# Altium schematic sheet VCU Schematic.SchDoc (part 1 of 2)
size E portrait; SheetNumber: 1; SheetTotal: 2
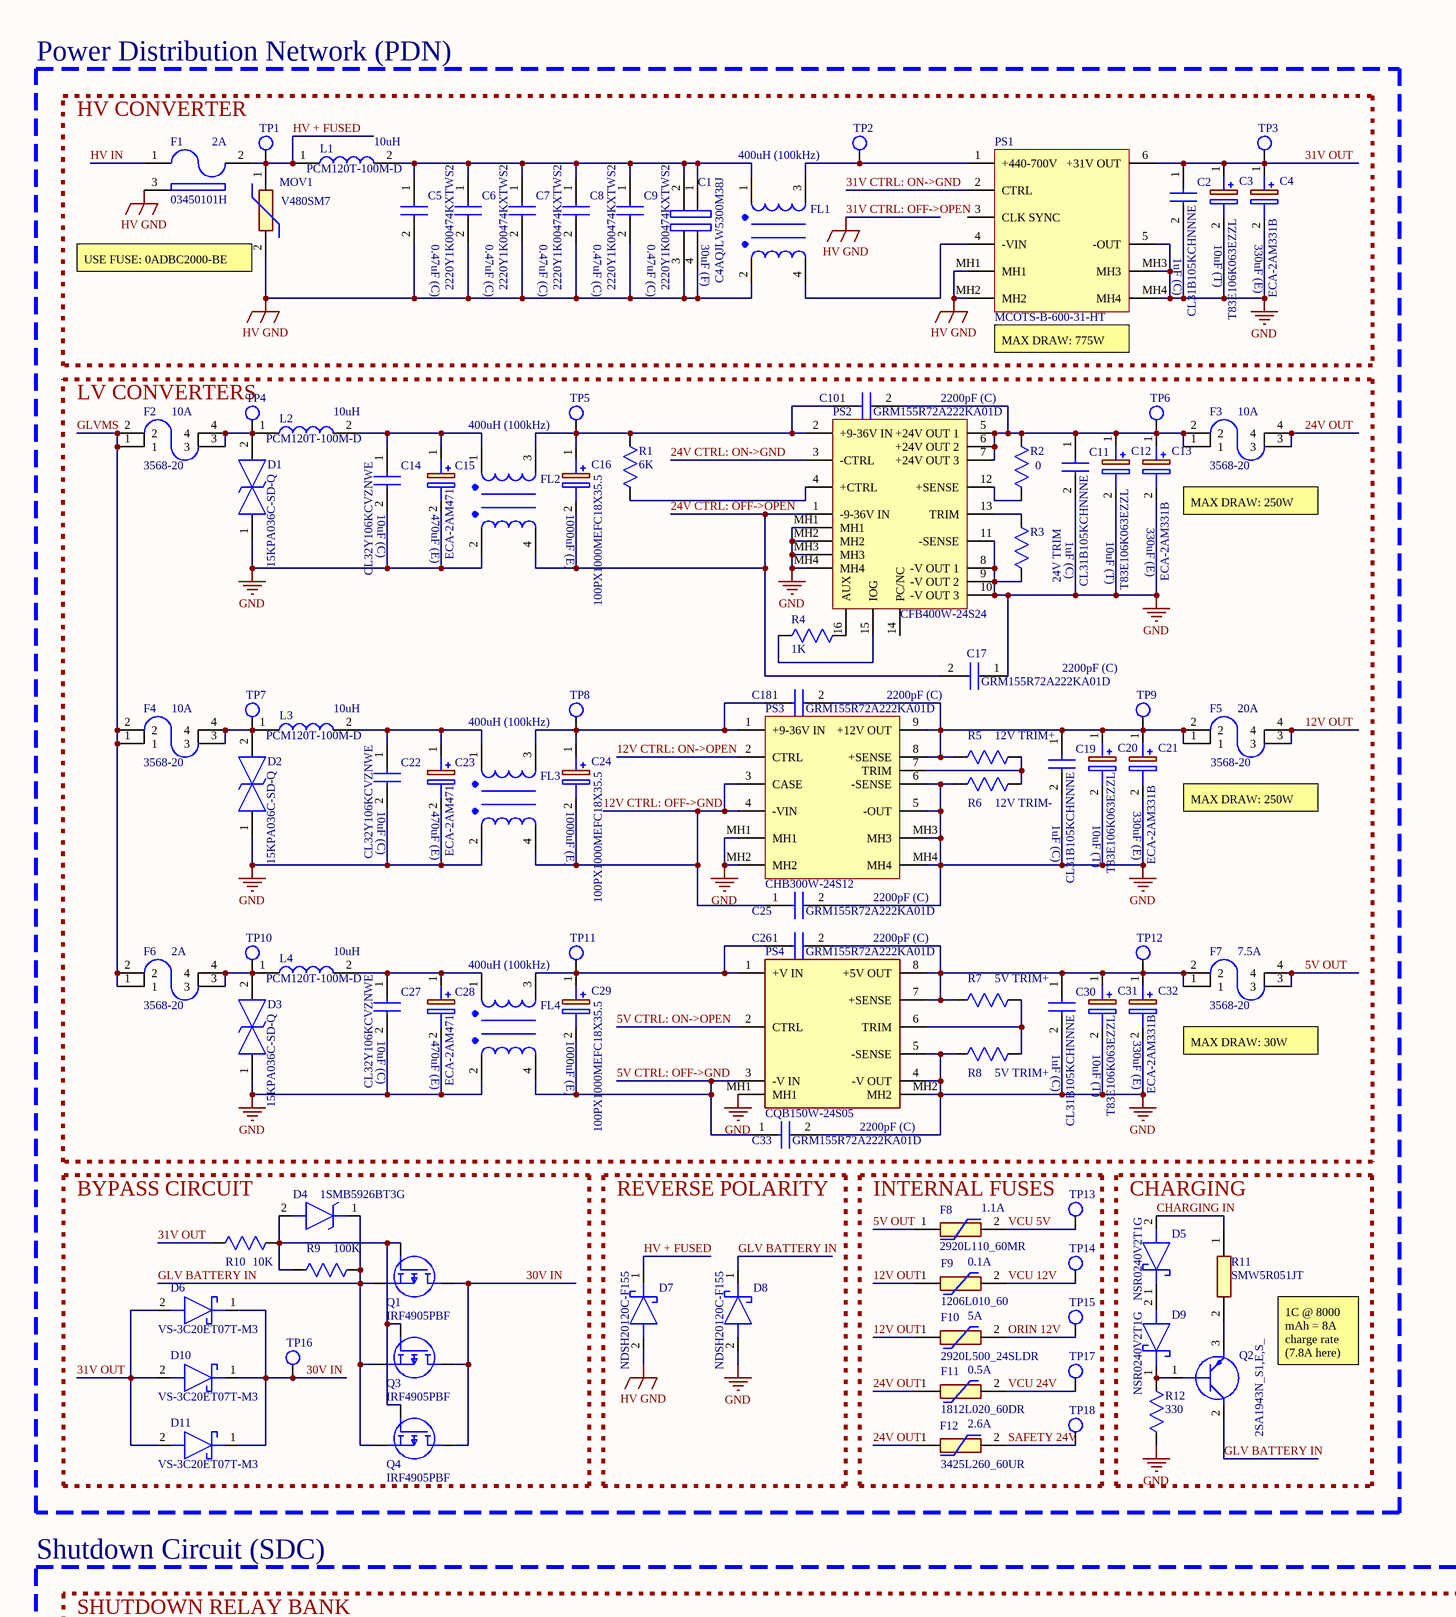
[diagram p0: VCU Schematic.SchDoc, top left]
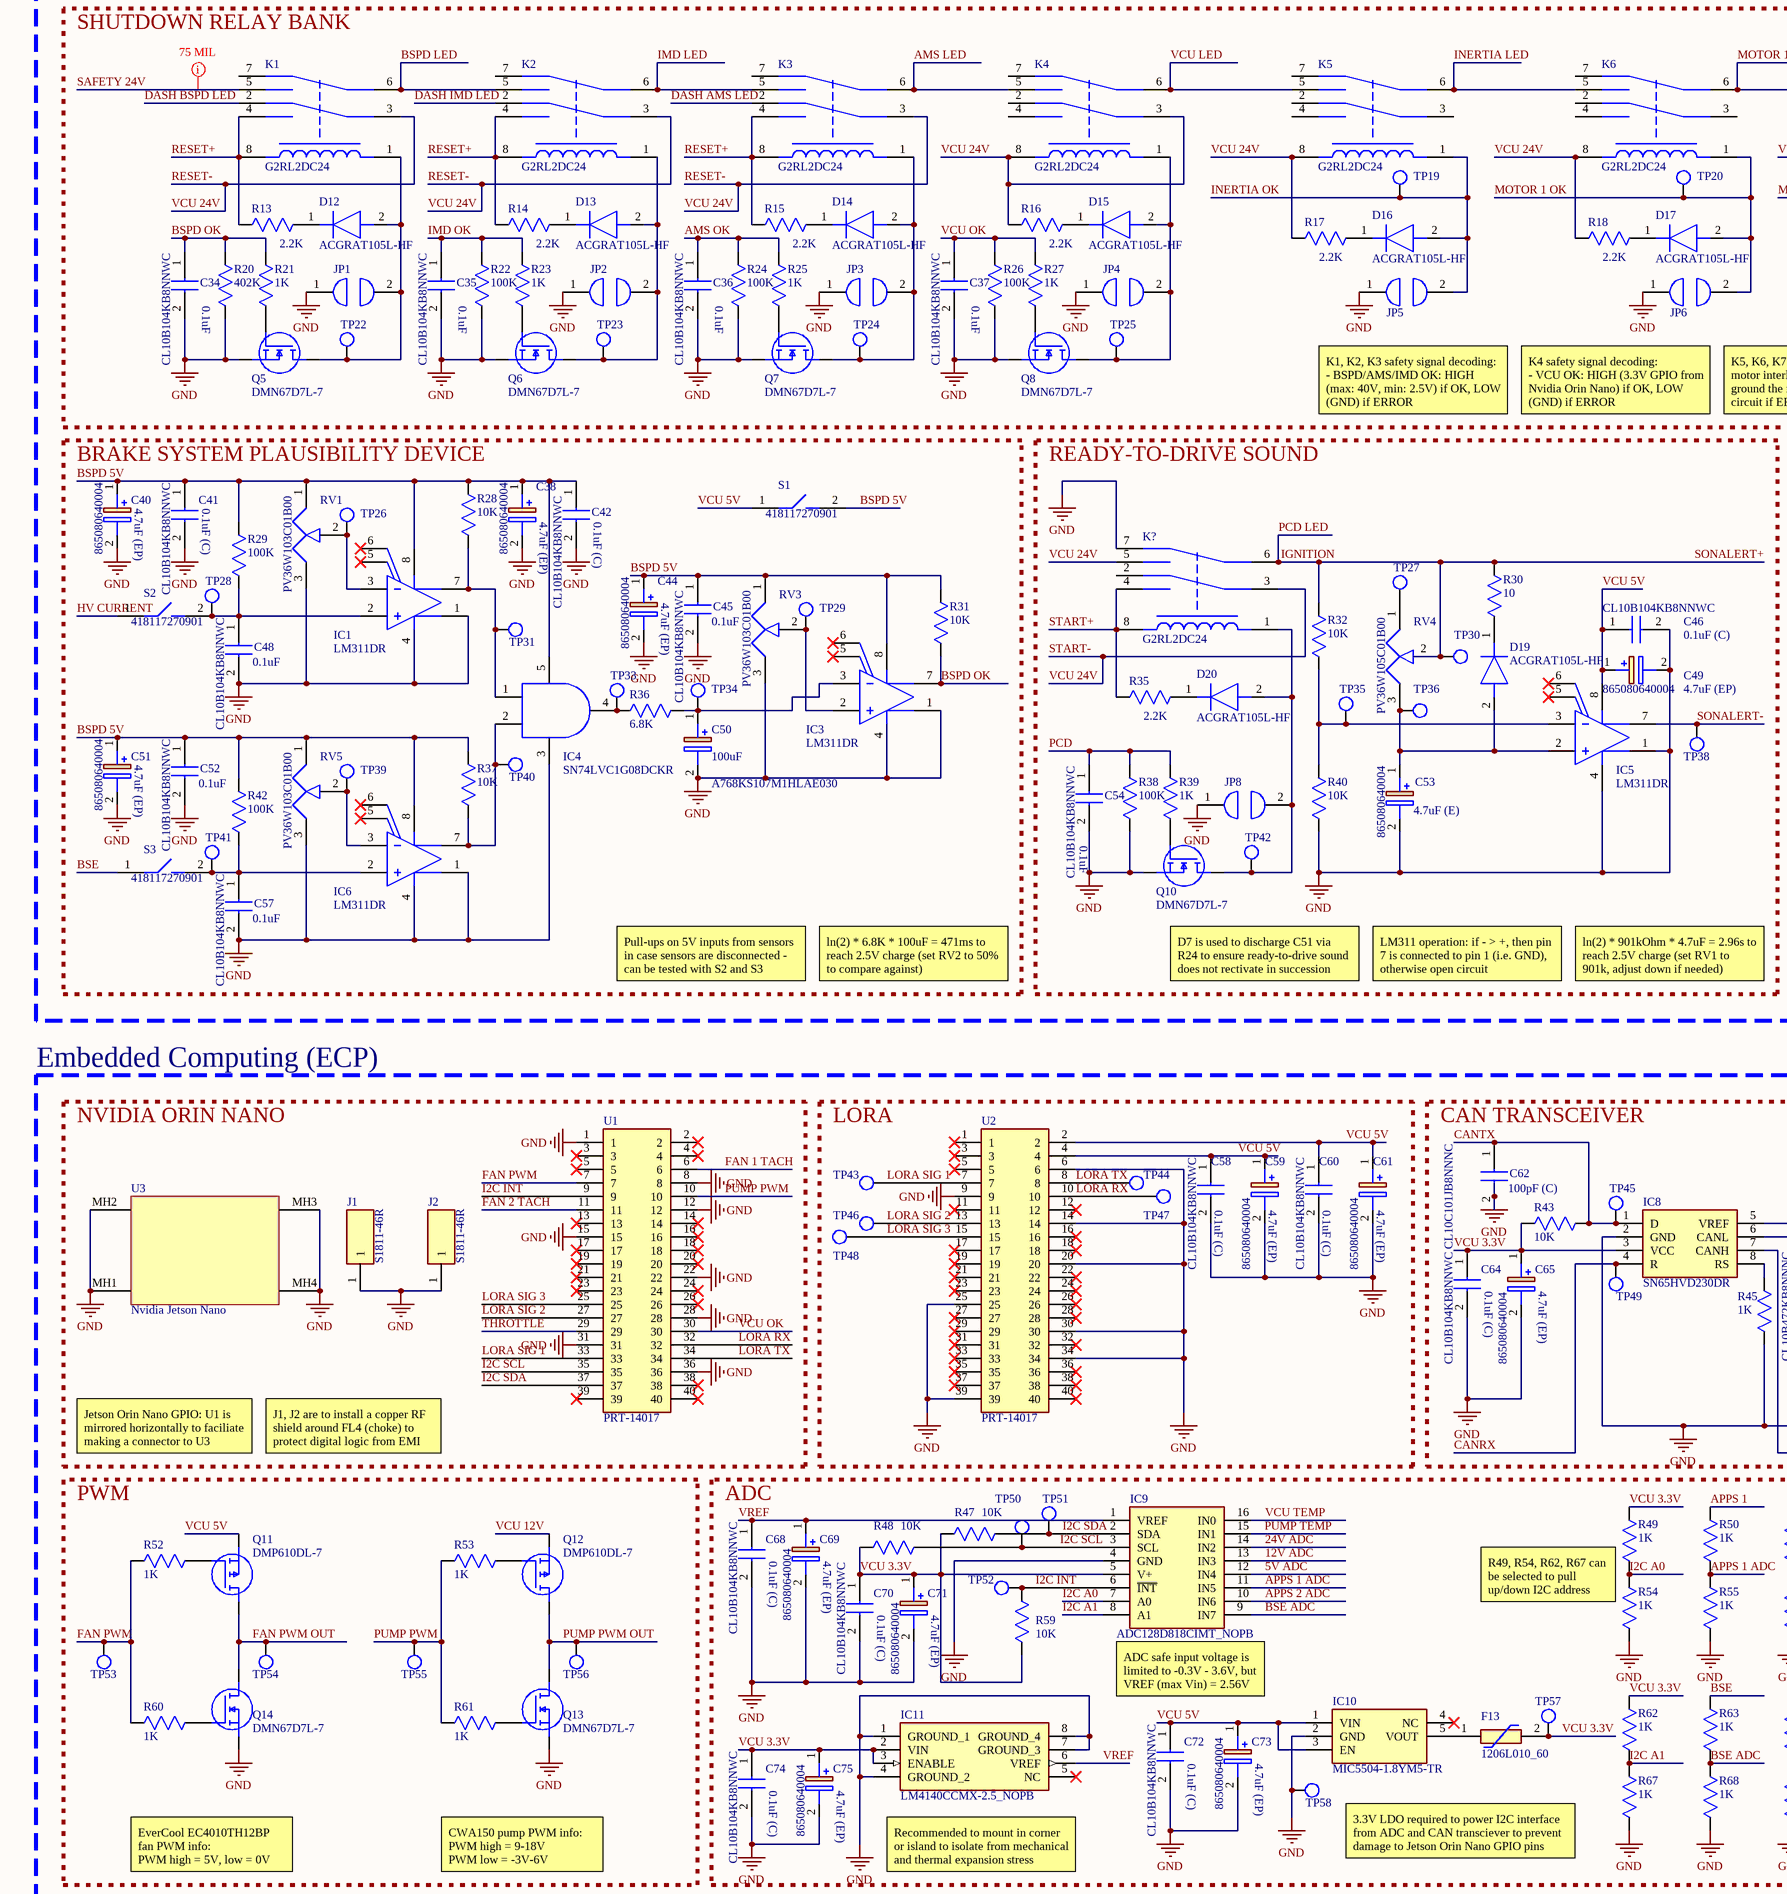
[diagram p1: VCU Schematic.SchDoc, centre left]
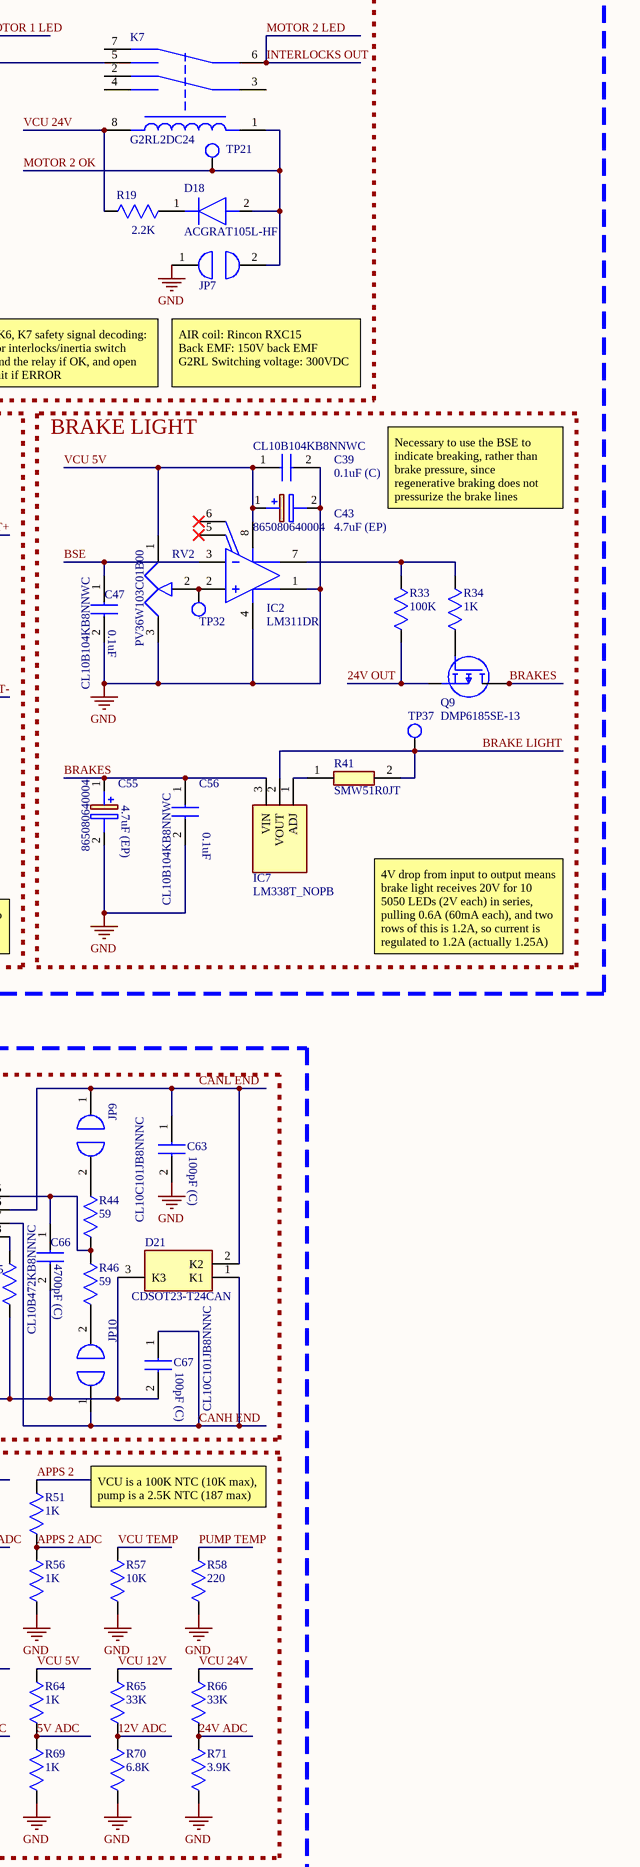
[diagram p2: VCU Schematic.SchDoc, centre right]
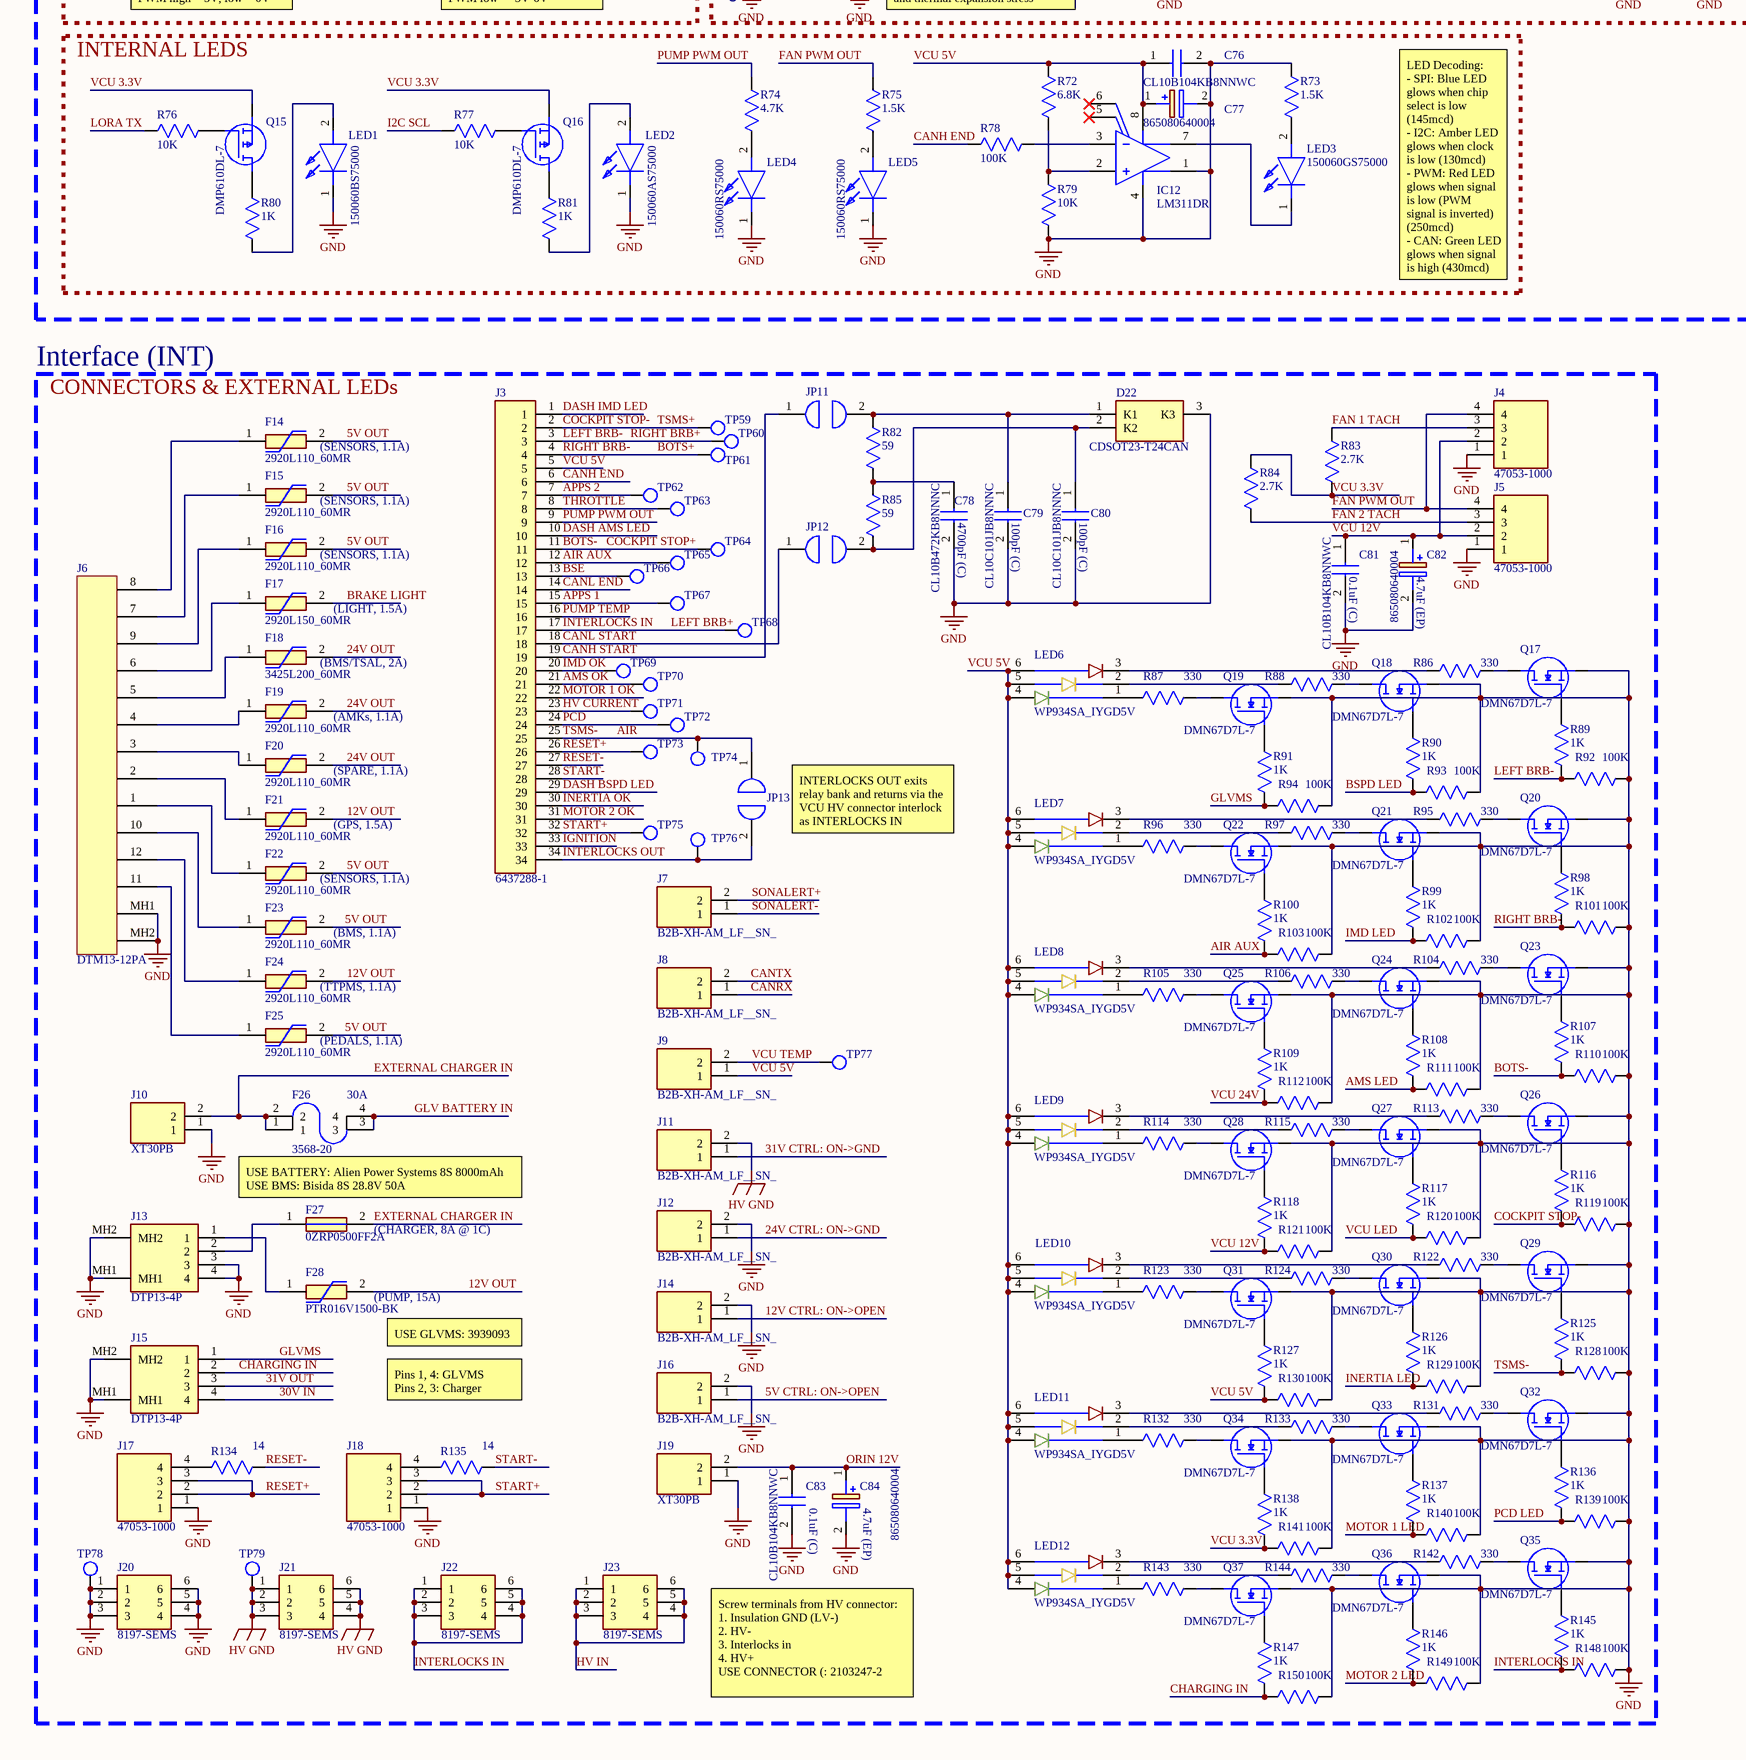
[diagram p3: VCU Schematic.SchDoc, bottom left]

## Parts
C1  C4AQJLW5300M38J  [C4AQJLW5300M38J]
C2  CL31B105KCHNNNE  [CAPC3216X180N]
C3  T83E106K063EZZL  [CAPPM7343X430N]
C4  ECA-2AM331B  [CAPPRD500W65D1250H2700]
C5  2220Y1K00474KXTWS2  [CAPC5750X420N]
C6  2220Y1K00474KXTWS2  [CAPC5750X420N]
C7  2220Y1K00474KXTWS2  [CAPC5750X420N]
C8  2220Y1K00474KXTWS2  [CAPC5750X420N]
C9  2220Y1K00474KXTWS2  [CAPC5750X420N]
C10  GRM155R72A222KA01D  [CAPC1005X55N]
C11  CL31B105KCHNNNE  [CAPC3216X180N]
C12  T83E106K063EZZL  [CAPPM7343X430N]
C13  ECA-2AM331B  [CAPPRD500W65D1250H2700]
C14  CL32Y106KCVZNWE  [CAPC3225X280N]
C15  ECA-2AM471  [CAPPRD750W85D1625H2700]
C16  100PX1000MEFC18X35.5  [CAPPRD750W80D1825H3750]
C17  GRM155R72A222KA01D  [CAPC1005X55N]
C18  GRM155R72A222KA01D  [CAPC1005X55N]
C19  CL31B105KCHNNNE  [CAPC3216X180N]
C20  T83E106K063EZZL  [CAPPM7343X430N]
C21  ECA-2AM331B  [CAPPRD500W65D1250H2700]
C22  CL32Y106KCVZNWE  [CAPC3225X280N]
C23  ECA-2AM471  [CAPPRD750W85D1625H2700]
C24  100PX1000MEFC18X35.5  [CAPPRD750W80D1825H3750]
C25  GRM155R72A222KA01D  [CAPC1005X55N]
C26  GRM155R72A222KA01D  [CAPC1005X55N]
C27  CL32Y106KCVZNWE  [CAPC3225X280N]
C28  ECA-2AM471  [CAPPRD750W85D1625H2700]
C29  100PX1000MEFC18X35.5  [CAPPRD750W80D1825H3750]
C30  CL31B105KCHNNNE  [CAPC3216X180N]
C31  T83E106K063EZZL  [CAPPM7343X430N]
C32  ECA-2AM331B  [CAPPRD500W65D1250H2700]
C33  GRM155R72A222KA01D  [CAPC1005X55N]
C34  CL10B104KB8NNWC  [CAPC1608X90N]
C35  CL10B104KB8NNWC  [CAPC1608X90N]
C36  CL10B104KB8NNWC  [CAPC1608X90N]
C37  CL10B104KB8NNWC  [CAPC1608X90N]
C38  865080640004  [865080640004]
C39  CL10B104KB8NNWC  [CAPC1608X90N]
C40  865080640004  [865080640004]
C41  CL10B104KB8NNWC  [CAPC1608X90N]
C42  CL10B104KB8NNWC  [CAPC1608X90N]
C43  865080640004  [865080640004]
C44  865080640004  [865080640004]
C45  CL10B104KB8NNWC  [CAPC1608X90N]
C46  CL10B104KB8NNWC  [CAPC1608X90N]
C47  CL10B104KB8NNWC  [CAPC1608X90N]
C48  CL10B104KB8NNWC  [CAPC1608X90N]
C49  865080640004  [865080640004]
C50  A768KS107M1HLAE030  [CAPAE830X1250N]
C51  865080640004  [865080640004]
C52  CL10B104KB8NNWC  [CAPC1608X90N]
C53  865080640004  [865080640004]
C54  CL10B104KB8NNWC  [CAPC1608X90N]
C55  865080640004  [865080640004]
C56  CL10B104KB8NNWC  [CAPC1608X90N]
C57  CL10B104KB8NNWC  [CAPC1608X90N]
C58  CL10B104KB8NNWC  [CAPC1608X90N]
C59  865080640004  [865080640004]
C60  CL10B104KB8NNWC  [CAPC1608X90N]
C61  865080640004  [865080640004]
C62  CL10C101JB8NNNC  [CAPC1608X90N]
C63  CL10C101JB8NNNC  [CAPC1608X90N]
C64  CL10B104KB8NNWC  [CAPC1608X90N]
C65  865080640004  [865080640004]
C66  CL10B472KB8NNNC  [CAPC1608X90N]
C67  CL10C101JB8NNNC  [CAPC1608X90N]
C68  CL10B104KB8NNWC  [CAPC1608X90N]
C69  865080640004  [865080640004]
C70  CL10B104KB8NNWC  [CAPC1608X90N]
C71  865080640004  [865080640004]
C72  CL10B104KB8NNWC  [CAPC1608X90N]
C73  865080640004  [865080640004]
C74  CL10B104KB8NNWC  [CAPC1608X90N]
C75  865080640004  [865080640004]
C76  CL10B104KB8NNWC  [CAPC1608X90N]
C77  865080640004  [865080640004]
C78  CL10B472KB8NNNC  [CAPC1608X90N]
C79  CL10C101JB8NNNC  [CAPC1608X90N]
C80  CL10C101JB8NNNC  [CAPC1608X90N]
C81  CL10B104KB8NNWC  [CAPC1608X90N]
C82  865080640004  [865080640004]
C83  CL10B104KB8NNWC  [CAPC1608X90N]
C84  865080640004  [865080640004]
D1  15KPA036C-SD-Q  [15KPA048CSDQ]
D2  15KPA036C-SD-Q  [15KPA048CSDQ]
D3  15KPA036C-SD-Q  [15KPA048CSDQ]
D4  1SMB5926BT3G  [DIOM5436X247N]
D5  NSR0240V2T1G  [SODFL1608X70N]
D6  VS-3C20ET07T-M3  [TO508P465X1031X1970-2P]
D7  NDSH20120C-F155  [TO1112P482X1562X2475-2P]
D8  NDSH20120C-F155  [TO1112P482X1562X2475-2P]
D9  NSR0240V2T1G  [SODFL1608X70N]
D10  VS-3C20ET07T-M3  [TO508P465X1031X1970-2P]
D11  VS-3C20ET07T-M3  [TO508P465X1031X1970-2P]
D12  ACGRAT105L-HF  [DIOC4522X116N]
D13  ACGRAT105L-HF  [DIOC4522X116N]
D14  ACGRAT105L-HF  [DIOC4522X116N]
D15  ACGRAT105L-HF  [DIOC4522X116N]
D16  ACGRAT105L-HF  [DIOC4522X116N]
D17  ACGRAT105L-HF  [DIOC4522X116N]
D18  ACGRAT105L-HF  [DIOC4522X116N]
D19  ACGRAT105L-HF  [DIOC4522X116N]
D20  ACGRAT105L-HF  [DIOC4522X116N]
D21  CDSOT23-T24CAN  [SOT95P230X117-3N]
D22  CDSOT23-T24CAN  [SOT95P230X117-3N]
F1  03450101H  [03450101H]
F2  3568-20  [356820]
F3  3568-20  [356820]
F4  3568-20  [356820]
F5  3568-20  [356820]
F6  3568-20  [356820]
F7  3568-20  [356820]
F8  2920L110_60MR  [2920L07560MR]
F9  1206L010_60  [1206L075132WR]
F10  2920L500_24SLDR  [2920L700SLPR]
F11  1812L020_60DR  [1812L010DR]
F12  3425L260_60UR  [FUSC8664X300N]
F13  1206L010_60  [1206L075132WR]
F14  2920L110_60MR  [2920L07560MR]
F15  2920L110_60MR  [2920L07560MR]
F16  2920L110_60MR  [2920L07560MR]
F17  2920L150_60MR  [FUSC7451X180N]
F18  3425L200_60MR  [FUSC8664X180N]
F19  2920L110_60MR  [2920L07560MR]
F20  2920L110_60MR  [2920L07560MR]
F21  2920L110_60MR  [2920L07560MR]
F22  2920L110_60MR  [2920L07560MR]
F23  2920L110_60MR  [2920L07560MR]
F24  2920L110_60MR  [2920L07560MR]
F25  2920L110_60MR  [2920L07560MR]
F26  3568-20  [356820]
F27  0ZRP0500FF2A  [0ZRP0500FF2A]
F28  PTR016V1500-BK  [PTR016V1500BK]
FL1  (no value)  [SCF19XV1501R3A006JV]
FL2  (no value)  [SCF19XV1501R3A006JV]
FL3  (no value)  [SCF19XV1501R3A006JV]
FL4  (no value)  [SCF19XV1501R3A006JV]
IC1  LM311DR  [SOIC127P600X175-8N]
IC2  LM311DR  [SOIC127P600X175-8N]
IC3  LM311DR  [SOIC127P600X175-8N]
IC4  SN74LVC1G08DCKR  [SOT65P210X110-5N]
IC5  LM311DR  [SOIC127P600X175-8N]
IC6  LM311DR  [SOIC127P600X175-8N]
IC7  LM338T_NOPB  [TO254P470X1028X1955-3P]
IC8  SN65HVD230DR  [SOT127P600X175-8N]
IC9  ADC128D818CIMT_NOPB  [SOP65P640X120-16N]
IC10  MIC5504-1.8YM5-TR  [SOT95P280X145-5N]
IC11  LM4140CCMX-2.5_NOPB  [SOIC127P600X175-8N]
IC12  LM311DR  [SOIC127P600X175-8N]
J1  S1811-46R  [S181146R]
J2  S1811-46R  [S181146R]
J3  6437288-1  [6437288-1]
J4  47053-1000  [470531000]
J5  47053-1000  [470531000]
J6  DTM13-12PA  [PCBComponent_1]
J7  B2B-XH-AM_LF__SN_  [B2BXHAMLFSN]
J8  B2B-XH-AM_LF__SN_  [B2BXHAMLFSN]
J9  B2B-XH-AM_LF__SN_  [B2BXHAMLFSN]
J10  XT30PB  [XT30PB]
J11  B2B-XH-AM_LF__SN_  [B2BXHAMLFSN]
J12  B2B-XH-AM_LF__SN_  [B2BXHAMLFSN]
J13  DTP13-4P  [DTP134P]
J14  B2B-XH-AM_LF__SN_  [B2BXHAMLFSN]
J15  DTP13-4P  [DTP134P]
J16  B2B-XH-AM_LF__SN_  [B2BXHAMLFSN]
J17  47053-1000  [470531000]
J18  47053-1000  [470531000]
J19  XT30PB  [XT30PB]
J20  8197-SEMS  [8197SEMS]
J21  8197-SEMS  [8197SEMS]
J22  8197-SEMS  [8197SEMS]
J23  8197-SEMS  [8197SEMS]
JP1  TD-101-G-A  [SAMTEC_TD-101-G-A]  (value not drawn)
JP2  TD-101-G-A  [SAMTEC_TD-101-G-A]  (value not drawn)
JP3  TD-101-G-A  [SAMTEC_TD-101-G-A]  (value not drawn)
JP4  TD-101-G-A  [SAMTEC_TD-101-G-A]  (value not drawn)
JP5  TD-101-G-A  [SAMTEC_TD-101-G-A]  (value not drawn)
JP6  TD-101-G-A  [SAMTEC_TD-101-G-A]  (value not drawn)
JP7  TD-101-G-A  [SAMTEC_TD-101-G-A]  (value not drawn)
JP8  TD-101-G-A  [SAMTEC_TD-101-G-A]  (value not drawn)
JP9  TD-101-G-A  [SAMTEC_TD-101-G-A]  (value not drawn)
JP10  TD-101-G-A  [SAMTEC_TD-101-G-A]  (value not drawn)
JP11  TD-101-G-A  [SAMTEC_TD-101-G-A]  (value not drawn)
JP12  TD-101-G-A  [SAMTEC_TD-101-G-A]  (value not drawn)
JP13  TD-101-G-A  [SAMTEC_TD-101-G-A]  (value not drawn)
K1  G2RL2DC24  [G2RL24CF12DC]
K2  G2RL2DC24  [G2RL24CF12DC]
K3  G2RL2DC24  [G2RL24CF12DC]
K4  G2RL2DC24  [G2RL24CF12DC]
K5  G2RL2DC24  [G2RL24CF12DC]
K6  G2RL2DC24  [G2RL24CF12DC]
K7  G2RL2DC24  [G2RL24CF12DC]
K?  G2RL2DC24  [G2RL24CF12DC]
L1  PCM120T-100M-D  [PCM120T100MD]
L2  PCM120T-100M-D  [PCM120T100MD]
L3  PCM120T-100M-D  [PCM120T100MD]
L4  PCM120T-100M-D  [PCM120T100MD]
LED1  150060BS75000  [LEDC1608X80N]
LED2  150060AS75000  [LEDC1608X80N]
LED3  150060GS75000  [LEDC1608X80N]
LED4  150060RS75000  [LEDC1608X80N]
LED5  150060RS75000  [LEDC1608X80N]
LED6  WP934SA_IYGD5V  [WP934SAIYGD5V]
LED7  WP934SA_IYGD5V  [WP934SAIYGD5V]
LED8  WP934SA_IYGD5V  [WP934SAIYGD5V]
LED9  WP934SA_IYGD5V  [WP934SAIYGD5V]
LED10  WP934SA_IYGD5V  [WP934SAIYGD5V]
LED11  WP934SA_IYGD5V  [WP934SAIYGD5V]
LED12  WP934SA_IYGD5V  [WP934SAIYGD5V]
MOV1  V480SM7  [V480SM7]
PS1  MCOTS-B-600-31-HT  [REC300H2415SW]
PS2  CFB400W-24S24  [CFB400W24S24]
PS3  CHB300W-24S12  [REC300H2415SW]
PS4  CQB150W-24S05  [CQB150W24S05]
Q1  IRF4905PBF  [TO254P469X1042X1967-3P]
Q2  2SA1943N_S1,E,S_  [TO545P470X1550X2420-3P]
Q3  IRF4905PBF  [TO254P469X1042X1967-3P]
Q4  IRF4905PBF  [TO254P469X1042X1967-3P]
Q5  DMN67D7L-7  [SOT96P240X110-3N]
Q6  DMN67D7L-7  [SOT96P240X110-3N]
Q7  DMN67D7L-7  [SOT96P240X110-3N]
Q8  DMN67D7L-7  [SOT96P240X110-3N]
Q9  DMP6185SE-13  [SOT230P700X180-4N]
Q10  DMN67D7L-7  [SOT96P240X110-3N]
Q11  DMP610DL-7  [SOT96P240X110-3N]
Q12  DMP610DL-7  [SOT96P240X110-3N]
Q13  DMN67D7L-7  [SOT96P240X110-3N]
Q14  DMN67D7L-7  [SOT96P240X110-3N]
Q15  DMP610DL-7  [SOT96P240X110-3N]
Q16  DMP610DL-7  [SOT96P240X110-3N]
Q17  DMN67D7L-7  [SOT96P240X110-3N]
Q18  DMN67D7L-7  [SOT96P240X110-3N]
Q19  DMN67D7L-7  [SOT96P240X110-3N]
Q20  DMN67D7L-7  [SOT96P240X110-3N]
Q21  DMN67D7L-7  [SOT96P240X110-3N]
Q22  DMN67D7L-7  [SOT96P240X110-3N]
Q23  DMN67D7L-7  [SOT96P240X110-3N]
Q24  DMN67D7L-7  [SOT96P240X110-3N]
Q25  DMN67D7L-7  [SOT96P240X110-3N]
Q26  DMN67D7L-7  [SOT96P240X110-3N]
Q27  DMN67D7L-7  [SOT96P240X110-3N]
Q28  DMN67D7L-7  [SOT96P240X110-3N]
Q29  DMN67D7L-7  [SOT96P240X110-3N]
Q30  DMN67D7L-7  [SOT96P240X110-3N]
Q31  DMN67D7L-7  [SOT96P240X110-3N]
Q32  DMN67D7L-7  [SOT96P240X110-3N]
Q33  DMN67D7L-7  [SOT96P240X110-3N]
Q34  DMN67D7L-7  [SOT96P240X110-3N]
Q35  DMN67D7L-7  [SOT96P240X110-3N]
Q36  DMN67D7L-7  [SOT96P240X110-3N]
Q37  DMN67D7L-7  [SOT96P240X110-3N]
R1  6K  [RESC3216X75N]
R2  0  [RESC3216X75N]
R3  24V TRIM  [RESC3216X75N]
R4  1K  [RESC3216X75N]
R5  12V TRIM+  [RESC3216X75N]
R6  12V TRIM-  [RESC3216X75N]
R7  5V TRIM+  [RESC3216X75N]
R8  5V TRIM+  [RESC3216X75N]
R9  100K  [RESC3216X75N]
R10  10K  [RESC3216X75N]
R11  SMW5R051JT  [RESM17073X710N]
R12  330  [RESC3216X75N]
R13  2.2K  [RESC3216X75N]
R14  2.2K  [RESC3216X75N]
R15  2.2K  [RESC3216X75N]
R16  2.2K  [RESC3216X75N]
R17  2.2K  [RESC3216X75N]
R18  2.2K  [RESC3216X75N]
R19  2.2K  [RESC3216X75N]
R20  402K  [RESC3216X75N]
R21  1K  [RESC3216X75N]
R22  100K  [RESC3216X75N]
R23  1K  [RESC3216X75N]
R24  100K  [RESC3216X75N]
R25  1K  [RESC3216X75N]
R26  100K  [RESC3216X75N]
R27  1K  [RESC3216X75N]
R28  10K  [RESC3216X75N]
R29  100K  [RESC3216X75N]
R30  10  [RESC3216X75N]
R31  10K  [RESC3216X75N]
R32  10K  [RESC3216X75N]
R33  100K  [RESC3216X75N]
R34  1K  [RESC3216X75N]
R35  2.2K  [RESC3216X75N]
R36  6.8K  [RESC3216X75N]
R37  10K  [RESC3216X75N]
R38  100K  [RESC3216X75N]
R39  1K  [RESC3216X75N]
R40  10K  [RESC3216X75N]
R41  SMW51R0JT  [RESM17073X710N]
R42  100K  [RESC3216X75N]
R43  10K  [RESC3216X75N]
R44  59  [RESC3216X75N]
R45  1K  [RESC3216X75N]
R46  59  [RESC3216X75N]
R47  10K  [RESC3216X75N]
R48  10K  [RESC3216X75N]
R49  1K  [RESC3216X75N]
R50  1K  [RESC3216X75N]
R51  1K  [RESC3216X75N]
R52  1K  [RESC3216X75N]
R53  1K  [RESC3216X75N]
R54  1K  [RESC3216X75N]
R55  1K  [RESC3216X75N]
R56  1K  [RESC3216X75N]
R57  10K  [RESC3216X75N]
R58  220  [RESC3216X75N]
R59  10K  [RESC3216X75N]
R60  1K  [RESC3216X75N]
R61  1K  [RESC3216X75N]
R62  1K  [RESC3216X75N]
R63  1K  [RESC3216X75N]
R64  1K  [RESC3216X75N]
R65  33K  [RESC3216X75N]
R66  33K  [RESC3216X75N]
R67  1K  [RESC3216X75N]
R68  1K  [RESC3216X75N]
R69  1K  [RESC3216X75N]
R70  6.8K  [RESC3216X75N]
R71  3.9K  [RESC3216X75N]
R72  6.8K  [RESC3216X75N]
R73  1.5K  [RESC3216X75N]
R74  4.7K  [RESC3216X75N]
R75  1.5K  [RESC3216X75N]
R76  10K  [RESC3216X75N]
R77  10K  [RESC3216X75N]
R78  100K  [RESC3216X75N]
R79  10K  [RESC3216X75N]
R80  1K  [RESC3216X75N]
R81  1K  [RESC3216X75N]
R82  59  [RESC3216X75N]
R83  2.7K  [RESC3216X75N]
R84  2.7K  [RESC3216X75N]
R85  59  [RESC3216X75N]
R86  330  [RESC3216X75N]
R87  330  [RESC3216X75N]
R88  330  [RESC3216X75N]
R89  1K  [RESC3216X75N]
R90  1K  [RESC3216X75N]
R91  1K  [RESC3216X75N]
R92  100K  [RESC3216X75N]
R93  100K  [RESC3216X75N]
R94  100K  [RESC3216X75N]
R95  330  [RESC3216X75N]
R96  330  [RESC3216X75N]
R97  330  [RESC3216X75N]
R98  1K  [RESC3216X75N]
R99  1K  [RESC3216X75N]
R100  1K  [RESC3216X75N]
R101  100K  [RESC3216X75N]
R102  100K  [RESC3216X75N]
R103  100K  [RESC3216X75N]
R104  330  [RESC3216X75N]
R105  330  [RESC3216X75N]
R106  330  [RESC3216X75N]
R107  1K  [RESC3216X75N]
R108  1K  [RESC3216X75N]
R109  1K  [RESC3216X75N]
R110  100K  [RESC3216X75N]
R111  100K  [RESC3216X75N]
R112  100K  [RESC3216X75N]
R113  330  [RESC3216X75N]
R114  330  [RESC3216X75N]
R115  330  [RESC3216X75N]
R116  1K  [RESC3216X75N]
R117  1K  [RESC3216X75N]
R118  1K  [RESC3216X75N]
R119  100K  [RESC3216X75N]
R120  100K  [RESC3216X75N]
R121  100K  [RESC3216X75N]
R122  330  [RESC3216X75N]
R123  330  [RESC3216X75N]
R124  330  [RESC3216X75N]
R125  1K  [RESC3216X75N]
R126  1K  [RESC3216X75N]
R127  1K  [RESC3216X75N]
R128  100K  [RESC3216X75N]
R129  100K  [RESC3216X75N]
R130  100K  [RESC3216X75N]
R131  330  [RESC3216X75N]
R132  330  [RESC3216X75N]
R133  330  [RESC3216X75N]
R134  14  [RESC3216X75N]
R135  14  [RESC3216X75N]
R136  1K  [RESC3216X75N]
R137  1K  [RESC3216X75N]
R138  1K  [RESC3216X75N]
R139  100K  [RESC3216X75N]
R140  100K  [RESC3216X75N]
R141  100K  [RESC3216X75N]
R142  330  [RESC3216X75N]
R143  330  [RESC3216X75N]
R144  330  [RESC3216X75N]
R145  1K  [RESC3216X75N]
R146  1K  [RESC3216X75N]
R147  1K  [RESC3216X75N]
R148  100K  [RESC3216X75N]
R149  100K  [RESC3216X75N]
R150  100K  [RESC3216X75N]
RV1  PV36W103C01B00  [PV36W201C01B00]
RV2  PV36W103C01B00  [PV36W201C01B00]
RV3  PV36W103C01B00  [PV36W201C01B00]
RV4  PV36W105C01B00  [PV36W105C01B00]
RV5  PV36W103C01B00  [PV36W201C01B00]
S1  418117270901  [418117270901]
S2  418117270901  [418117270901]
S3  418117270901  [418117270901]
TP1  5010  [5010]  (value not drawn)
TP2  5010  [5010]  (value not drawn)
TP3  5010  [5010]  (value not drawn)
TP4  5010  [5010]  (value not drawn)
TP5  5010  [5010]  (value not drawn)
TP6  5010  [5010]  (value not drawn)
TP7  5010  [5010]  (value not drawn)
TP8  5010  [5010]  (value not drawn)
TP9  5010  [5010]  (value not drawn)
TP10  5010  [5010]  (value not drawn)
TP11  5010  [5010]  (value not drawn)
TP12  5010  [5010]  (value not drawn)
TP13  5010  [5010]  (value not drawn)
TP14  5010  [5010]  (value not drawn)
TP15  5010  [5010]  (value not drawn)
TP16  5010  [5010]  (value not drawn)
TP17  5010  [5010]  (value not drawn)
TP18  5010  [5010]  (value not drawn)
TP19  5010  [5010]  (value not drawn)
TP20  5010  [5010]  (value not drawn)
TP21  5010  [5010]  (value not drawn)
TP22  5010  [5010]  (value not drawn)
TP23  5010  [5010]  (value not drawn)
TP24  5010  [5010]  (value not drawn)
TP25  5010  [5010]  (value not drawn)
TP26  5010  [5010]  (value not drawn)
TP27  5010  [5010]  (value not drawn)
TP28  5010  [5010]  (value not drawn)
TP29  5010  [5010]  (value not drawn)
TP30  5010  [5010]  (value not drawn)
TP31  5010  [5010]  (value not drawn)
TP32  5010  [5010]  (value not drawn)
TP33  5010  [5010]  (value not drawn)
TP34  5010  [5010]  (value not drawn)
TP35  5010  [5010]  (value not drawn)
TP36  5010  [5010]  (value not drawn)
TP37  5010  [5010]  (value not drawn)
TP38  5010  [5010]  (value not drawn)
TP39  5010  [5010]  (value not drawn)
TP40  5010  [5010]  (value not drawn)
TP41  5010  [5010]  (value not drawn)
TP42  5010  [5010]  (value not drawn)
TP43  5010  [5010]  (value not drawn)
TP44  5010  [5010]  (value not drawn)
TP45  5010  [5010]  (value not drawn)
TP46  5010  [5010]  (value not drawn)
TP47  5010  [5010]  (value not drawn)
TP48  5010  [5010]  (value not drawn)
TP49  5010  [5010]  (value not drawn)
TP50  5010  [5010]  (value not drawn)
TP51  5010  [5010]  (value not drawn)
TP52  5010  [5010]  (value not drawn)
TP53  5010  [5010]  (value not drawn)
TP54  5010  [5010]  (value not drawn)
TP55  5010  [5010]  (value not drawn)
TP56  5010  [5010]  (value not drawn)
TP57  5010  [5010]  (value not drawn)
TP58  5010  [5010]  (value not drawn)
TP59  5010  [5010]  (value not drawn)
TP60  5010  [5010]  (value not drawn)
TP61  5010  [5010]  (value not drawn)
TP62  5010  [5010]  (value not drawn)
TP63  5010  [5010]  (value not drawn)
TP64  5010  [5010]  (value not drawn)
TP65  5010  [5010]  (value not drawn)
TP66  5010  [5010]  (value not drawn)
TP67  5010  [5010]  (value not drawn)
TP68  5010  [5010]  (value not drawn)
TP69  5010  [5010]  (value not drawn)
TP70  5010  [5010]  (value not drawn)
TP71  5010  [5010]  (value not drawn)
TP72  5010  [5010]  (value not drawn)
TP73  5010  [5010]  (value not drawn)
TP74  5010  [5010]  (value not drawn)
TP75  5010  [5010]  (value not drawn)
TP76  5010  [5010]  (value not drawn)
TP77  5010  [5010]  (value not drawn)
TP78  5010  [5010]  (value not drawn)
TP79  5010  [5010]  (value not drawn)
U1  PRT-14017  [RHDR40W64P254_2X20_5130X500X1375P]
U2  PRT-14017  [RHDR40W64P254_2X20_5130X500X1375P]
U3  Nvidia Jetson Nano  [PWM Fan Driver Module-Footprint-1]

## Blocks framed on the sheet
HV CONVERTER: C1-C9 F1 FL1 L1 MOV1 PS1 TP1-TP3
LV CONVERTERS: C10-C33 D1-D3 F2-F7 FL2-FL4 L2-L4 PS2-PS4 R1-R8 TP4-TP12
BYPASS CIRCUIT: D4 D6 D10 D11 Q1 Q3 Q4 R9 R10 TP16
REVERSE POLARITY: D7 D8
INTERNAL FUSES: F8-F12 TP13-TP15 TP17 TP18
CHARGING: D5 D9 Q2 R11 R12
SHUTDOWN RELAY BANK: C34-C37 D12-D18 JP1-JP7 K1-K7 Q5-Q8 R13-R27 TP19-TP25
BRAKE SYSTEM PLAUSIBILITY DEVICE: C38 C40-C42 C44 C45 C48 C50-C52 C57 IC1 IC3 IC4 IC6 R28 R29 R31 R36 R37 R42 RV1 RV3 RV5 S1-S3 TP26 TP28 TP29 TP31 TP33 TP34 TP39-TP41
READY-TO-DRIVE SOUND: C46 C49 C53 C54 D19 D20 IC5 JP8 K? Q10 R30 R32 R35 R38-R40 RV4 TP27 TP30 TP35 TP36 TP38 TP42
BRAKE LIGHT: C39 C43 C47 C55 C56 IC2 IC7 Q9 R33 R34 R41 RV2 TP32 TP37
NVIDIA ORIN NANO: J1 J2 U1 U3
LORA: C58-C61 TP43 TP44 TP46-TP48 U2
CAN TRANSCEIVER: C62-C67 D21 IC8 JP9 JP10 R43-R46 TP45 TP49
PWM: Q11-Q14 R52 R53 R60 R61 TP53-TP56
ADC: C68-C75 F13 IC9-IC11 R47-R51 R54-R59 R62-R71 TP50-TP52 TP57 TP58
INTERNAL LEDS: C76 C77 IC12 LED1-LED5 Q15 Q16 R72-R81
Interface (INT): C78-C84 D22 F14-F28 J3-J23 JP11-JP13 LED6-LED12 Q17-Q37 R82-R150 TP59-TP79

## Nets
31V CTRL: OFF->OPEN: C1.3 C1.4 C5.2 C6.2 C7.2 C8.2 C9.2 D7.2(A) F1.3 FL1.2 J11.2 J21.1 J21.2 J21.3 J21.4 J21.5 J21.6 MOV1.2 PS1.MH1 PS1.MH2 TP79.1  [also labelled HV GND]
GND: C2.2 C3.2(-) C4.2(-) C11.2 C12.2(-) C13.2(-) C14.2 C15.2(-) C17.1 C19.2 C20.2(-) C21.2(-) C22.2 C23.2(-) C25.2 C27.2 C28.2(-) C30.2 C31.2(-) C32.2(-) C33.2 C34.2 C35.2 C36.2 C37.2 C38.2(-) C39.2 C40.2(-) C41.2 C42.2 C43.2(-) C44.2(-) C45.2 C46.2 C47.2 C48.2 C49.2(-) C50.2(-) C51.2(-) C52.2 C53.2(-) C54.2 C55.2(-) C56.2 C57.2 C58.2 C59.2(-) C60.2 C61.2(-) C62.2 C63.2 C64.2 C65.2(-) C66.2 C67.2 C68.2 C69.2(-) C70.2 C71.2(-) C72.2 C73.2(-) C74.2 C75.2(-) C76.2 C77.2(-) C78.2 C79.2 C80.2 C81.2 C82.2(-) C83.2 C84.2(-) D1.1 D2.1 D3.1 D8.2(A) D21.3(K3) D22.3(K3) FL2.2 FL3.2 FL4.2 IC1.1(EMIT_OUT) IC1.4(VCC-) IC2.1(EMIT_OUT) IC3.1(EMIT_OUT) IC3.4(VCC-) IC4.3(GND) IC5.1(EMIT_OUT) IC6.1(EMIT_OUT) IC6.4(VCC-) IC8.2(GND) IC9.4(GND) IC10.2(GND) IC11.1(GROUND_1) IC11.4(GROUND_2) IC11.7(GROUND_3) IC11.8(GROUND_4) IC12.1(EMIT_OUT) J1.1 J2.1 J4.1 J5.1 J6.MH1 J6.MH2 J10.1 J12.2 J13.3 J13.4 J13.MH1 J13.MH2 J14.2 J15.MH1 J15.MH2 J16.2 J17.1 J18.1 J19.1 J20.1 J20.2 J20.3 J20.4 J20.5 J20.6 JP1.1 JP2.1 JP3.1 JP4.1 JP5.1 JP6.1 JP7.1 JP8.1 K?.7(NC_2) LED1.1(K) LED2.1(K) LED4.1(K) LED5.1(K) PS1.5(-OUT) PS1.MH3 PS1.MH4 PS2.8(-V_OUT_1) PS2.9(-V_OUT_2) PS2.10(-V_OUT_3) PS2.11(-SENSE) PS2.MH1 PS2.MH2 PS2.MH3 PS2.MH4 PS3.5(-OUT) PS3.6(-SENSE) PS3.MH1 PS3.MH2 PS3.MH3 PS3.MH4 PS4.4(-V_OUT) PS4.5(-SENSE) PS4.MH1 PS4.MH2 Q5.2(S) Q6.2(S) Q7.2(S) Q8.2(S) Q10.2(S) Q13.2(S) Q14.2(S) Q17.2(S) Q18.2(S) Q19.2(S) Q20.2(S) Q21.2(S) Q22.2(S) Q23.2(S) Q24.2(S) Q25.2(S) Q26.2(S) Q27.2(S) Q28.2(S) Q29.2(S) Q30.2(S) Q31.2(S) Q32.2(S) Q33.2(S) Q34.2(S) Q35.2(S) Q36.2(S) Q37.2(S) R3.1 R6.2 R8.2 R12.1 R20.1 R22.1 R24.1 R26.1 R38.1 R40.1 R45.1 R54.1 R55.1 R56.1 R57.1 R58.1 R67.1 R68.1 R69.1 R70.1 R71.1 R73.2 R79.1 R92.1 R93.1 R94.1 R101.1 R102.1 R103.1 R110.1 R111.1 R112.1 R119.1 R120.1 R121.1 R128.1 R129.1 R130.1 R139.1 R140.1 R141.1 R148.1 R149.1 R150.1 RV1.3 RV2.3 RV3.3 RV5.3 TP58.1 TP78.1 U1.1 U1.8 U1.12 U1.15 U1.22 U1.28 U1.31 U1.36 U2.6 U2.9 U2.14 U2.20 U2.25 U2.30 U2.34 U2.39 U3.MH1 U3.MH2 U3.MH3 U3.MH4
5V ADC: IC9.12(IN4) R64.1 R69.2
5V CTRL: OFF->GND: C29.2(-) C33.1 FL4.4 PS4.3(-V_IN)
5V CTRL: ON->OPEN: J16.1 PS4.2(CTRL)
5V OUT: F7.3 F7.4 F8.1 F14.2 F15.2 F16.2 F22.2 F23.2 F25.2
12V ADC: IC9.13(IN3) R65.1 R70.2
12V CTRL: OFF->GND: C24.2(-) C25.1 FL3.4 PS3.3(CASE) PS3.4(-VIN)
12V CTRL: ON->OPEN: J14.1 PS3.2(CTRL)
12V OUT: F5.3 F5.4 F9.1 F10.1 F21.2 F24.2 F28.2
24V ADC: IC9.14(IN2) R66.1 R71.2
24V CTRL: OFF->OPEN: C16.2(-) C17.2 FL2.4 PS2.1(-9-36V_IN)
24V CTRL: ON->GND: J12.1 PS2.3(-CTRL)
24V OUT: F3.3 F3.4 F11.1 F12.1 F18.2 F19.2 F20.2 Q9.3(S) R33.1
30V IN: D6.1(K) D10.1(K) D11.1(K) J15.4 Q1.2(D) Q3.2(D) Q4.2(D) TP16.1
31V CTRL: ON->GND: J11.1 PS1.2(CTRL)
31V OUT: C2.1 C3.1(+) C4.1(+) D6.2(A) D10.2(A) D11.2(A) J15.3 PS1.6(+31V_OUT) R10.2 TP3.1
AIR: J3.25 JP13.1 R125.1 R128.2 TP74.1  [also labelled TSMS-]
AIR AUX: J3.12 R100.1 R103.2 TP65.1
AMS LED: K3.6(COM_2) K4.5(NO_1) R108.1 R111.2
AMS OK: C36.1 J3.21 R24.2 R25.2 TP70.1
APPS 1: J3.15 R50.2 TP67.1
APPS 1 ADC: IC9.11(IN5) R50.1 R55.2
APPS 2: J3.7 R51.2 TP62.1
APPS 2 ADC: IC9.10(IN6) R51.1 R56.2
BOTS+: J3.4 R98.1 R101.2 TP61.1  [also labelled RIGHT BRB-]
BOTS-: J3.11 R107.1 R110.2 TP64.1  [also labelled COCKPIT STOP+]
BRAKE LIGHT: F17.2 IC7.2(VOUT) R41.2 TP37.1
BRAKES: C55.1(+) C56.1 IC7.3(VIN) Q9.2(D_1) Q9.4(D_2)
BSE: C47.1 IC2.3(IN-) J3.13 R63.2 S3.1(COM) TP66.1
BSE ADC: IC9.9(IN7) R63.1 R68.2
BSPD 5V: C38.1(+) C40.1(+) C41.1 C42.1 C44.1(+) C45.1 C51.1(+) C52.1 IC1.8(VCC+) IC3.8(VCC+) IC4.5(VCC) IC6.8(VCC+) R28.2 R29.2 R31.2 R37.2 R42.2 RV1.1 RV3.1 RV5.1 S1.2(NO)
BSPD LED: K1.6(COM_2) K2.5(NO_1) R90.1 R93.2
BSPD OK: C34.1 IC3.7(COL_OUT) R20.2 R21.2 R31.1
CANH END: C67.1 D21.1(K1) IC8.7(CANH) J3.6 JP10.1 R78.2
CANH START: J3.19 JP11.1
CANL END: C63.1 D21.2(K2) IC8.6(CANL) J3.14 JP9.1
CANL START: J3.18 JP12.1
CANRX: IC8.4(R) J8.1 TP49.1
CANTX: C62.1 IC8.1(D) J8.2 R43.1 TP45.1
CHARGING IN: D5.2(A) J15.2 R11.1 R147.1 R150.2
COCKPIT STOP-: J3.2 R116.1 R119.2 TP59.1  [also labelled TSMS+]
DASH AMS LED: J3.10 K3.2(NC_1)
DASH BSPD LED: J3.29 K1.2(NC_1)
DASH IMD LED: J3.1 K2.2(NC_1)
EXTERNAL CHARGER IN: F26.1 F26.2 F27.2 J10.2
FAN 1 TACH: J4.3 R83.1 U1.6
FAN 2 TACH: J5.3 R84.2 U1.11
FAN PWM: R52.2 R60.2 TP53.1 U1.7
FAN PWM OUT: J4.4 J5.4 Q11.3(D) Q14.3(D) R75.2 TP54.1
GLV BATTERY IN: D4.1(K) D8.1(K) F26.3 F26.4 Q1.3(S) Q2.2(C) Q3.3(S) Q4.3(S) R9.1
GLVMS: F2.1 F2.2 F4.1 F4.2 F6.1 F6.2 J15.1 R91.1 R94.2
HV + FUSED: D7.1(K) F1.2 L1.1 MOV1.1 TP1.1
HV CURRENT: J3.23 S2.1(COM) TP71.1
HV IN: F1.1 J23.1 J23.2 J23.3 J23.4 J23.5 J23.6
I2C A0: IC9.7(A0) R49.1 R54.2
I2C A1: IC9.8(A1) R62.1 R67.2
I2C INT: IC9.6(~{INT}) R59.1 TP52.1 U1.9
I2C SCL: IC9.3(SCL) R48.1 R77.2 TP50.1 U1.35
I2C SDA: IC9.2(SDA) R47.1 TP51.1 U1.37
IGNITION: J3.33 J7.2 K?.6(COM_2) R30.2 R32.2 R136.1 R139.2 RV4.2(WIPER) TP30.1  [also labelled PCD LED, SONALERT+]
IMD LED: K2.6(COM_2) K3.5(NO_1) R99.1 R102.2
IMD OK: C35.1 J3.20 R22.2 R23.2 TP69.1
INERTIA LED: K5.6(COM_2) K6.5(NO_1) R126.1 R129.2
INERTIA OK: D16.2(A) J3.30 JP5.2 K5.1(COIL_1) TP19.1
INTERLOCKS IN: J3.17 J22.1 J22.2 J22.3 J22.4 J22.5 J22.6 R145.1 R148.2 TP68.1  [also labelled LEFT BRB+]
INTERLOCKS OUT: J3.34 JP13.2 K7.6(COM_2) R146.1 R149.2 TP76.1  [also labelled MOTOR 2 LED]
LEFT BRB-: J3.3 R89.1 R92.2 TP60.1  [also labelled RIGHT BRB+]
LORA RX: TP47.1 U1.32 U2.10
LORA SIG 1: TP43.1 U1.33 U2.7
LORA SIG 2: TP46.1 U1.27 U2.13
LORA SIG 3: TP48.1 U1.25 U2.15
LORA TX: R76.2 TP44.1 U1.34 U2.8
MOTOR 1 LED: K6.6(COM_2) K7.5(NO_1) R137.1 R140.2
MOTOR 1 OK: D17.2(A) J3.22 JP6.2 K6.1(COIL_1) TP20.1
MOTOR 2 OK: D18.2(A) J3.31 JP7.2 K7.1(COIL_1) TP21.1
ORIN 12V: C83.1 C84.1(+) F10.2 J19.2 TP15.1
PCD: C54.1 J3.24 R38.2 R39.2 TP72.1
PUMP PWM: R53.2 R61.2 TP55.1 U1.10
PUMP PWM OUT: J3.9 Q12.3(D) Q13.3(D) R74.2 TP56.1
PUMP TEMP: IC9.15(IN1) J3.16 R58.2
RESET+: J3.26 J17.2 J17.3 K1.4(NO_2) K1.8(COIL_2) K2.4(NO_2) K2.8(COIL_2) K3.4(NO_2) K3.8(COIL_2) R13.2 R14.2 R15.2 TP73.1
RESET-: F11.2 J3.27 J3.28 K1.3(COM_1) K2.3(COM_1) K3.3(COM_1) K4.3(COM_1) K4.8(COIL_2) K5.8(COIL_2) K6.8(COIL_2) K7.8(COIL_2) K?.3(COM_1) K?.5(NO_1) R16.2 R17.2 R18.2 R19.2 R66.2 R109.1 R112.2 R134.1 R135.1 TP17.1  [also labelled START-, VCU 24V]
SAFETY 24V: F12.2 K1.5(NO_1) TP18.1
SONALERT-: IC5.7(COL_OUT) J7.1 TP38.1
START+: J3.32 J18.2 J18.3 K?.4(NO_2) K?.8(COIL_2) R35.2 TP75.1
THROTTLE: J3.8 TP63.1 U1.29
VCU 3.3V: C64.1 C65.1(+) C70.1 C71.1(+) C74.1 C75.1(+) F13.2 IC8.3(VCC) IC9.5(V+) IC11.2(VIN) IC11.3(ENABLE) Q15.2(S) Q16.2(S) R43.2 R47.2 R48.2 R49.2 R59.2 R62.2 R83.2 R84.1 R138.1 R141.2 TP57.1
VCU 5V: C39.1 C43.1(+) C46.1 C49.1(+) C58.1 C59.1(+) C60.1 C61.1(+) C72.1 C73.1(+) C76.1 C77.1(+) F8.2 IC2.8(VCC+) IC5.8(VCC+) IC10.1(VIN) IC10.3(EN) IC12.8(VCC+) J3.5 J9.1 LED6.4(A_1) LED6.5(A_2) LED6.6(A_3) LED7.4(A_1) LED7.5(A_2) LED7.6(A_3) LED8.4(A_1) LED8.5(A_2) LED8.6(A_3) LED9.4(A_1) LED9.5(A_2) LED9.6(A_3) LED10.4(A_1) LED10.5(A_2) LED10.6(A_3) LED11.4(A_1) LED11.5(A_2) LED11.6(A_3) LED12.4(A_1) LED12.5(A_2) LED12.6(A_3) Q11.2(S) R64.2 R72.2 R127.1 R130.2 RV2.1 S1.1(COM) TP13.1 U2.2 U2.4
VCU 12V: C81.1 C82.1(+) F9.2 J4.2 J5.2 Q12.2(S) R65.2 R118.1 R121.2 TP14.1
VCU LED: K4.6(COM_2) K5.5(NO_1) R117.1 R120.2
VCU OK: C37.1 R26.2 R27.2 U1.30
VCU TEMP: IC9.16(IN0) J9.2 R57.2 TP77.1
VREF: C68.1 C69.1(+) IC9.1(VREF) IC11.6(VREF)
NetC1_1: C1.1 C1.2 C5.1 C6.1 C7.1 C8.1 C9.1 FL1.1 L1.2
NetC10_1: C10.1 C16.1(+) FL2.3 PS2.2(+9-36V_IN) R1.2 TP5.1
NetC10_2: C10.2 C11.1 C12.1(+) C13.1(+) F3.1 F3.2 PS2.5(+24V_OUT_1) PS2.6(+24V_OUT_2) PS2.7(+24V_OUT_3) R2.2 TP6.1
NetC14_1: C14.1 C15.1(+) FL2.1 L2.2
NetC18_1: C18.1 C24.1(+) FL3.3 PS3.1(+9-36V_IN) TP8.1
NetC18_2: C18.2 C19.1 C20.1(+) C21.1(+) F5.1 F5.2 PS3.8(+SENSE) PS3.9(+12V_OUT) R5.2 TP9.1
NetC22_1: C22.1 C23.1(+) FL3.1 L3.2
NetC26_1: C26.1 C29.1(+) FL4.3 PS4.1(+V_IN) TP11.1
NetC26_2: C26.2 C30.1 C31.1(+) C32.1(+) F7.1 F7.2 PS4.7(+SENSE) PS4.8(+5V_OUT) R7.2 TP12.1
NetC27_1: C27.1 C28.1(+) FL4.1 L4.2
NetC48_1: C48.1 IC1.2(IN+) R29.1 S2.2(NO) TP28.1
NetC50_1: C50.1(+) IC3.3(IN-) R36.1 TP34.1
NetC53_1: C53.1(+) D19.2(A) IC5.2(IN+) RV4.3(CW) TP36.1
NetC57_1: C57.1 IC6.2(IN+) R42.1 S3.2(NO) TP41.1
NetC66_1: C66.1 IC8.5(VREF) R44.1 R46.2
NetC78_1: C78.1 R82.1 R85.2
NetC79_1: C79.1 D22.1(K1) JP11.2 R82.2
NetC80_1: C80.1 D22.2(K2) JP12.2 R85.1
NetD1_2: D1.2 F2.3 F2.4 L2.1 TP4.1
NetD2_2: D2.2 F4.3 F4.4 L3.1 TP7.1
NetD3_2: D3.2 F6.3 F6.4 L4.1 TP10.1
NetD4_2: D4.2(A) Q1.1(G) Q3.1(G) Q4.1(G) R9.2 R10.1
NetD5_1: D5.1(K) D9.2(A)
NetD9_1: D9.1(K) Q2.1(B) R12.2
NetD12_1: D12.1(K) R13.1
NetD12_2: D12.2(A) JP1.2 K1.1(COIL_1) Q5.3(D) TP22.1
NetD13_1: D13.1(K) R14.1
NetD13_2: D13.2(A) JP2.2 K2.1(COIL_1) Q6.3(D) TP23.1
NetD14_1: D14.1(K) R15.1
NetD14_2: D14.2(A) JP3.2 K3.1(COIL_1) Q7.3(D) TP24.1
NetD15_1: D15.1(K) R16.1
NetD15_2: D15.2(A) JP4.2 K4.1(COIL_1) Q8.3(D) TP25.1
NetD16_1: D16.1(K) R17.1
NetD17_1: D17.1(K) R18.1
NetD18_1: D18.1(K) R19.1
NetD19_1: D19.1(K) R30.1
NetD20_1: D20.1(K) R35.1
NetD20_2: D20.2(A) JP8.2 K?.1(COIL_1) Q10.3(D) TP42.1
NetF13_1: F13.1 IC10.5(VOUT)
NetF14_1: F14.1 J6.8
NetF15_1: F15.1 J6.7
NetF16_1: F16.1 J6.9
NetF17_1: F17.1 J6.6
NetF18_1: F18.1 J6.5
NetF19_1: F19.1 J6.4
NetF20_1: F20.1 J6.3
NetF21_1: F21.1 J6.2
NetF22_1: F22.1 J6.1
NetF23_1: F23.1 J6.10
NetF24_1: F24.1 J6.12
NetF25_1: F25.1 J6.11
NetF27_1: F27.1 J13.2
NetF28_1: F28.1 J13.1
NetFL1_3: FL1.3 PS1.1(+440-700V) TP2.1
NetFL1_4: FL1.4 PS1.4(-VIN)
NetIC1_3: IC1.3(IN-) RV1.2 TP26.1
NetIC1_7: IC1.7(COL_OUT) IC4.1(A) R28.1 TP31.1
NetIC2_2: IC2.2(IN+) RV2.2 TP32.1
NetIC2_7: IC2.7(COL_OUT) R33.2 R34.2
NetIC3_2: IC3.2(IN+) RV3.2 TP29.1
NetIC4_2: IC4.2(B) IC6.7(COL_OUT) R37.1 TP40.1
NetIC4_4: IC4.4(Y) R36.2 TP33.1
NetIC5_3: IC5.3(IN-) R32.1 R40.2 TP35.1
NetIC6_3: IC6.3(IN-) RV5.2 TP39.1
NetIC7_1: IC7.1(ADJ) R41.1
NetIC8_8: IC8.8(RS) R45.2
NetIC12_2: IC12.2(IN+) R72.1 R79.2
NetIC12_3: IC12.3(IN-) R78.1
NetIC12_7: IC12.7(COL_OUT) LED3.1(K)
NetJ17_4: J17.4 R134.2
NetJ18_4: J18.4 R135.2
NetJP9_2: JP9.2 R44.2
NetJP10_2: JP10.2 R46.1
NetLED1_2: LED1.2(A) R80.1
NetLED2_2: LED2.2(A) R81.1
NetLED3_2: LED3.2(A) R73.1
NetLED4_2: LED4.2(A) R74.1
NetLED5_2: LED5.2(A) R75.1
NetLED6_1: LED6.1(K_1) R87.2
NetLED6_2: LED6.2(K_2) R88.2
NetLED6_3: LED6.3(K_3) R86.2
NetLED7_1: LED7.1(K_1) R96.2
NetLED7_2: LED7.2(K_2) R97.2
NetLED7_3: LED7.3(K_3) R95.2
NetLED8_1: LED8.1(K_1) R105.2
NetLED8_2: LED8.2(K_2) R106.2
NetLED8_3: LED8.3(K_3) R104.2
NetLED9_1: LED9.1(K_1) R114.2
NetLED9_2: LED9.2(K_2) R115.2
NetLED9_3: LED9.3(K_3) R113.2
NetLED10_1: LED10.1(K_1) R123.2
NetLED10_2: LED10.2(K_2) R124.2
NetLED10_3: LED10.3(K_3) R122.2
NetLED11_1: LED11.1(K_1) R132.2
NetLED11_2: LED11.2(K_2) R133.2
NetLED11_3: LED11.3(K_3) R131.2
NetLED12_1: LED12.1(K_1) R143.2
NetLED12_2: LED12.2(K_2) R144.2
NetLED12_3: LED12.3(K_3) R142.2
NetPS2_4: PS2.4(+CTRL) R1.1
NetPS2_12: PS2.12(+SENSE) R2.1
NetPS2_13: PS2.13(TRIM) R3.2
NetPS2_15: PS2.15(IOG) R4.1
NetPS2_16: PS2.16(AUX) R4.2
NetPS3_7: PS3.7(TRIM) R5.1 R6.1
NetPS4_6: PS4.6(TRIM) R7.1 R8.1
NetQ2_3: Q2.3(E) R11.2
NetQ5_1: Q5.1(G) R21.1
NetQ6_1: Q6.1(G) R23.1
NetQ7_1: Q7.1(G) R25.1
NetQ8_1: Q8.1(G) R27.1
NetQ9_1: Q9.1(G) R34.1
NetQ10_1: Q10.1(G) R39.1
NetQ11_1: Q11.1(G) R52.1
NetQ12_1: Q12.1(G) R53.1
NetQ13_1: Q13.1(G) R61.1
NetQ14_1: Q14.1(G) R60.1
NetQ15_1: Q15.1(G) R76.1
NetQ15_3: Q15.3(D) R80.2
NetQ16_1: Q16.1(G) R77.1
NetQ16_3: Q16.3(D) R81.2
NetQ17_1: Q17.1(G) R89.2
NetQ17_3: Q17.3(D) R86.1
NetQ18_1: Q18.1(G) R90.2
NetQ18_3: Q18.3(D) R88.1
NetQ19_1: Q19.1(G) R91.2
NetQ19_3: Q19.3(D) R87.1
NetQ20_1: Q20.1(G) R98.2
NetQ20_3: Q20.3(D) R95.1
NetQ21_1: Q21.1(G) R99.2
NetQ21_3: Q21.3(D) R97.1
NetQ22_1: Q22.1(G) R100.2
NetQ22_3: Q22.3(D) R96.1
NetQ23_1: Q23.1(G) R107.2
NetQ23_3: Q23.3(D) R104.1
NetQ24_1: Q24.1(G) R108.2
NetQ24_3: Q24.3(D) R106.1
NetQ25_1: Q25.1(G) R109.2
NetQ25_3: Q25.3(D) R105.1
NetQ26_1: Q26.1(G) R116.2
NetQ26_3: Q26.3(D) R113.1
NetQ27_1: Q27.1(G) R117.2
NetQ27_3: Q27.3(D) R115.1
NetQ28_1: Q28.1(G) R118.2
NetQ28_3: Q28.3(D) R114.1
NetQ29_1: Q29.1(G) R125.2
NetQ29_3: Q29.3(D) R122.1
NetQ30_1: Q30.1(G) R126.2
NetQ30_3: Q30.3(D) R124.1
NetQ31_1: Q31.1(G) R127.2
NetQ31_3: Q31.3(D) R123.1
NetQ32_1: Q32.1(G) R136.2
NetQ32_3: Q32.3(D) R131.1
NetQ33_1: Q33.1(G) R137.2
NetQ33_3: Q33.3(D) R133.1
NetQ34_1: Q34.1(G) R138.2
NetQ34_3: Q34.3(D) R132.1
NetQ35_1: Q35.1(G) R145.2
NetQ35_3: Q35.3(D) R142.1
NetQ36_1: Q36.1(G) R146.2
NetQ36_3: Q36.3(D) R144.1
NetQ37_1: Q37.1(G) R147.2
NetQ37_3: Q37.3(D) R143.1
NetRV4_1: RV4.1(CCW) TP27.1

Not connected (* = marked no-connect by the designer): IC1 5(BALANCE)* 6(BAL/STRB)*; IC2 4(VCC-) 5(BALANCE)* 6(BAL/STRB)*; IC3 5(BALANCE)* 6(BAL/STRB)*; IC5 4(VCC-) 5(BALANCE)* 6(BAL/STRB)*; IC6 5(BALANCE)* 6(BAL/STRB)*; IC10 4(NC)*; IC11 5(NC)*; IC12 4(VCC-) 5(BALANCE)* 6(BAL/STRB)*; K1 7(NC_2); K2 7(NC_2); K3 7(NC_2); K4 2(NC_1) 4(NO_2) 7(NC_2); K5 2(NC_1) 3(COM_1) 4(NO_2) 7(NC_2); K6 2(NC_1) 3(COM_1) 4(NO_2) 7(NC_2); K7 2(NC_1) 3(COM_1) 4(NO_2) 7(NC_2); K? 2(NC_1); PS1 3(CLK_SYNC); PS2 14(PC/NC); U1 2* 3* 4* 5* 13* 14* 16* 17* 18* 19* 20* 21* 23* 24* 26* 38* 39* 40*; U2 1* 3* 5* 11* 12* 16* 17* 18* 19* 21* 22* 23* 24* 26* 27* 28* 29* 31* 32* 33* 35* 36* 37* 38* 40*

## Layout directives
mark named 75 MIL: SAFETY 24V

## Notes on the sheet
- Power Distribution Network (PDN)
- (near F1) 2A
- (near L1) 10uH
- 400uH (100kHz)
- (near MOV1) USE FUSE: 0ADBC2000-BE
- 0.47uF (C)
- (near C1) 30uF (F)
- 1uF (C)
- (near C3) 10uF (T)
- 330uF (E)
- (near PS1) MAX DRAW: 775W
- (near F2) 10A
- (near L2) 10uH
- (near PS2) 2200pF (C)
- (near F3) 10A
- (near C14) 10uF (C)
- (near C15) 470uF (E)
- (near C16) 1000uF (E)
- (near R3) 1uF (C)
- 10uF (T)
- MAX DRAW: 250W
- 2200pF (C)
- (near F4) 10A
- (near L3) 10uH
- (near F5) 20A
- (near C22) 10uF (C)
- (near C23) 470uF (E)
- (near C24) 1000uF (E)
- (near PS3) 2200pF (C)
- (near F6) 2A
- (near L4) 10uH
- (near PS4) 2200pF (C)
- (near F7) 7.5A
- (near C27) 10uF (C)
- (near C28) 470uF (E)
- (near C29) 1000uF (E)
- (near C32) 330uF (E)
- (near C31) 10uF (T)
- MAX DRAW: 30W
- (near F8) 1.1A
- (near F9) 0.1A
- (near F11) 0.5A
- (near F10) 5A
- 1C @ 8000 mAh = 8A charge rate (7.8A here)
- (near F12) 2.6A
- Shutdown Circuit (SDC)
- 0.1uF
- K1, K2, K3 safety signal decoding:
  - BSPD/AMS/IMD OK: HIGH (max: 40V, min: 2.5V) if OK, LOW (GND) if ERROR
- K4 safety signal decoding:
  - VCU OK: HIGH (3.3V GPIO from Nvidia Orin Nano) if OK, LOW (GND) if ERROR
- K5, K6, K7 safety signal decoding: motor interlocks/inertia switch ground the relay if OK, and open circuit if ERROR
- AIR coil: Rincon RXC15
  Back EMF: 150V back EMF
  G2RL Switching voltage: 300VDC
- (near C40) 4.7uF (EP)
- (near C41) 0.1uF (C)
- (near C38) 4.7uF (EP)
- (near C42) 0.1uF (C)
- 0.1uF (C)
- Necessary to use the BSE to indicate breaking, rather than brake pressure, since regenerative braking does not pressurize the brake lines
- (near C44) 4.7uF (EP)
- (near C43) 4.7uF (EP)
- (near C48) 0.1uF
- (near C47) 0.1uF
- 4.7uF (EP)
- (near C51) 4.7uF (EP)
- (near C50) 100uF
- (near C53) 4.7uF (E)
- (near C55) 4.7uF (EP)
- (near C56) 0.1uF
- (near C57) 0.1uF
- Pull-ups on 5V inputs from sensors in case sensors are disconnected - can be tested with S2 and S3
- ln(2) * 6.8K * 100uF = 471ms to reach 2.5V charge (set RV2 to 50% to compare against)
- D7 is used to discharge C51 via R24 to ensure ready-to-drive sound does not rectivate in succession
- LM311 operation: if - > +, then pin 7 is connected to pin 1 (i.e. GND), otherwise open circuit
- ln(2) * 901kOhm * 4.7uF = 2.96s to reach 2.5V charge (set RV1 to 901k, adjust down if needed)
- 4V drop from input to output means brake light receives 20V for 10 5050 LEDs (2V each) in series, pulling 0.6A (60mA each), and two rows of this is 1.2A, so current is regulated to 1.2A (actually 1.25A)
- Embedded Computing (ECP)
- (near C58) 0.1uF (C)
- (near C59) 4.7uF (EP)
- (near C60) 0.1uF (C)
- (near C61) 4.7uF (EP)
- (near C62) 100pF (C)
- (near C63) 100pF (C)
- (near C64) 0.1uF (C)
- (near C65) 4.7uF (EP)
- (near C66) 4700pF (C)
- (near C67) 100pF (C)
- Jetson Orin Nano GPIO: U1 is mirrored horizontally to faciliate making a connector to U3
- J1, J2 are to install a copper RF shield around FL4 (choke) to protect digital logic from EMI
- VCU is a 100K NTC (10K max), pump is a 2.5K NTC (187 max)
- (near C68) 0.1uF (C)
- (near C69) 4.7uF (EP)
- (near C70) 0.1uF (C)
- (near C71) 4.7uF (EP)
- R49, R54, R62, R67 can be selected to pull up/down I2C address
- ADC safe input voltage is limited to -0.3V - 3.6V, but VREF (max Vin) = 2.56V
- (near C74) 0.1uF (C)
- (near C75) 4.7uF (EP)
- (near C72) 0.1uF (C)
- (near C73) 4.7uF (EP)
- EverCool EC4010TH12BP fan PWM info:
  PWM high = 5V, low = 0V
- CWA150 pump PWM info:
  PWM high = 9-18V
  PWM low = -3V-6V
- (near IC11) Recommended to mount in corner or island to isolate from mechanical and thermal expansion stress
- 3.3V LDO required to power I2C interface from ADC and CAN transciever to prevent damage to Jetson Orin Nano GPIO pins
- LED Decoding:
  - SPI: Blue LED glows when chip select is low (145mcd)
  - I2C: Amber LED glows when clock is low (130mcd)
  - PWM: Red LED glows when signal is low (PWM signal is inverted) (250mcd)
  - CAN: Green LED glows when signal is high (430mcd)
- (near F14) CONNECTORS & EXTERNAL LEDs
- (near F14) (SENSORS, 1.1A)
- (near F15) (SENSORS, 1.1A)
- (near F16) (SENSORS, 1.1A)
- (near C78) 4700pF (C)
- (near C79) 100pF (C)
- (near C80) 100pF (C)
- (near F17) (LIGHT, 1.5A)
- (near C81) 0.1uF (C)
- (near C82) 4.7uF (EP)
- (near F18) (BMS/TSAL, 2A)
- (near F19) (AMKs, 1.1A)
- (near F21) (GPS, 1.5A)
- (near F20) (SPARE, 1.1A)
- (near JP13) INTERLOCKS OUT exits relay bank and returns via the VCU HV connector interlock as INTERLOCKS IN
- (near F22) (SENSORS, 1.1A)
- (near F23) (BMS, 1.1A)
- (near F24) (TTPMS, 1.1A)
- (near F25) (PEDALS, 1.1A)
- (near F26) 30A
- USE BATTERY: Alien Power Systems 8S 8000mAh
  USE BMS: Bisida 8S 28.8V 50A
- (near F27) (CHARGER, 8A @ 1C)
- (near F28) (PUMP, 15A)
- (near F28) USE GLVMS: 3939093
- Pins 1, 4: GLVMS
  Pins 2, 3: Charger
- (near C83) 0.1uF (C)
- (near C84) 4.7uF (EP)
- Screw terminals from HV connector:
  1. Insulation GND (LV-)
  2. HV-
  3. Interlocks in
  4. HV+
  USE CONNECTOR (: 2103247-2